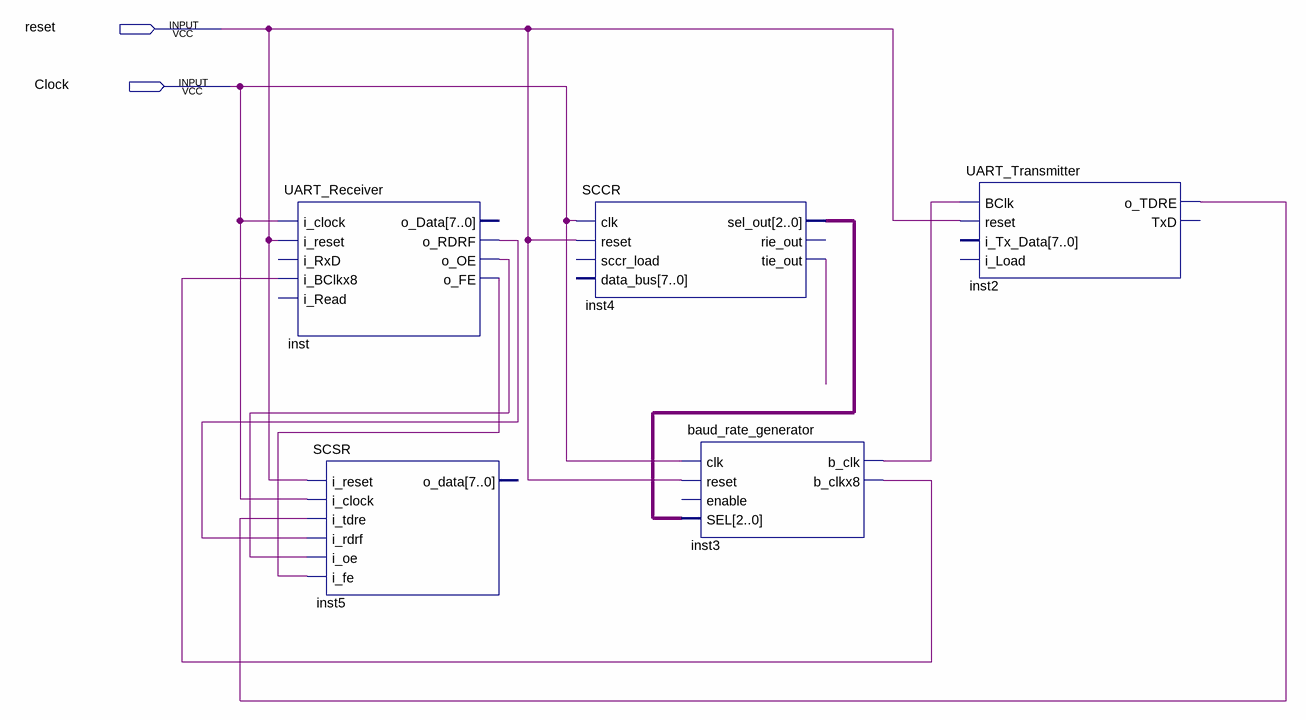
[diagram p0: schematic sheet]
// Quartus schematic Block1.bdf as structural Verilog: 5 symbols, 2 pins
module Block1 (
  input  reset,
  input  Clock
);

  wire inst2_o_tdre, inst3_b_clk, inst3_b_clkx8, inst4_tie_out, inst_o_fe, inst_o_oe, inst_o_rdrf;
  wire [2:0] inst4_sel_out;

  UART_Receiver inst (
    .i_clock(Clock), .i_reset(reset), .i_BClkx8(inst3_b_clkx8), .o_RDRF(inst_o_rdrf), .o_OE(inst_o_oe),
    .o_FE(inst_o_fe));  // open: i_RxD, i_Read, o_Data
  SCSR inst5 (
    .i_reset(reset), .i_clock(Clock), .i_tdre(inst2_o_tdre), .i_rdrf(inst_o_rdrf), .i_oe(inst_o_oe),
    .i_fe(inst_o_fe));  // open: o_data
  SCCR inst4 (
    .clk(Clock), .reset(reset), .sel_out(inst4_sel_out), .tie_out(inst4_tie_out));  // open: sccr_load, data_bus, rie_out
  baud_rate_generator inst3 (
    .clk(Clock), .reset(reset), .SEL(inst4_sel_out), .b_clk(inst3_b_clk), .b_clkx8(inst3_b_clkx8));  // open: enable
  UART_Transmitter inst2 (.BClk(inst3_b_clk), .reset(reset), .o_TDRE(inst2_o_tdre));  // open: i_Tx_Data, i_Load, TxD
endmodule
